# Altium schematic sheet Sensor_Temp.SchDoc: ZStation Sensor Temp
size A4; Engineer: Stephan Eersels; DocumentNumber: 12202925_ZS; Revision: 2.1; SheetNumber: 4; SheetTotal: 8
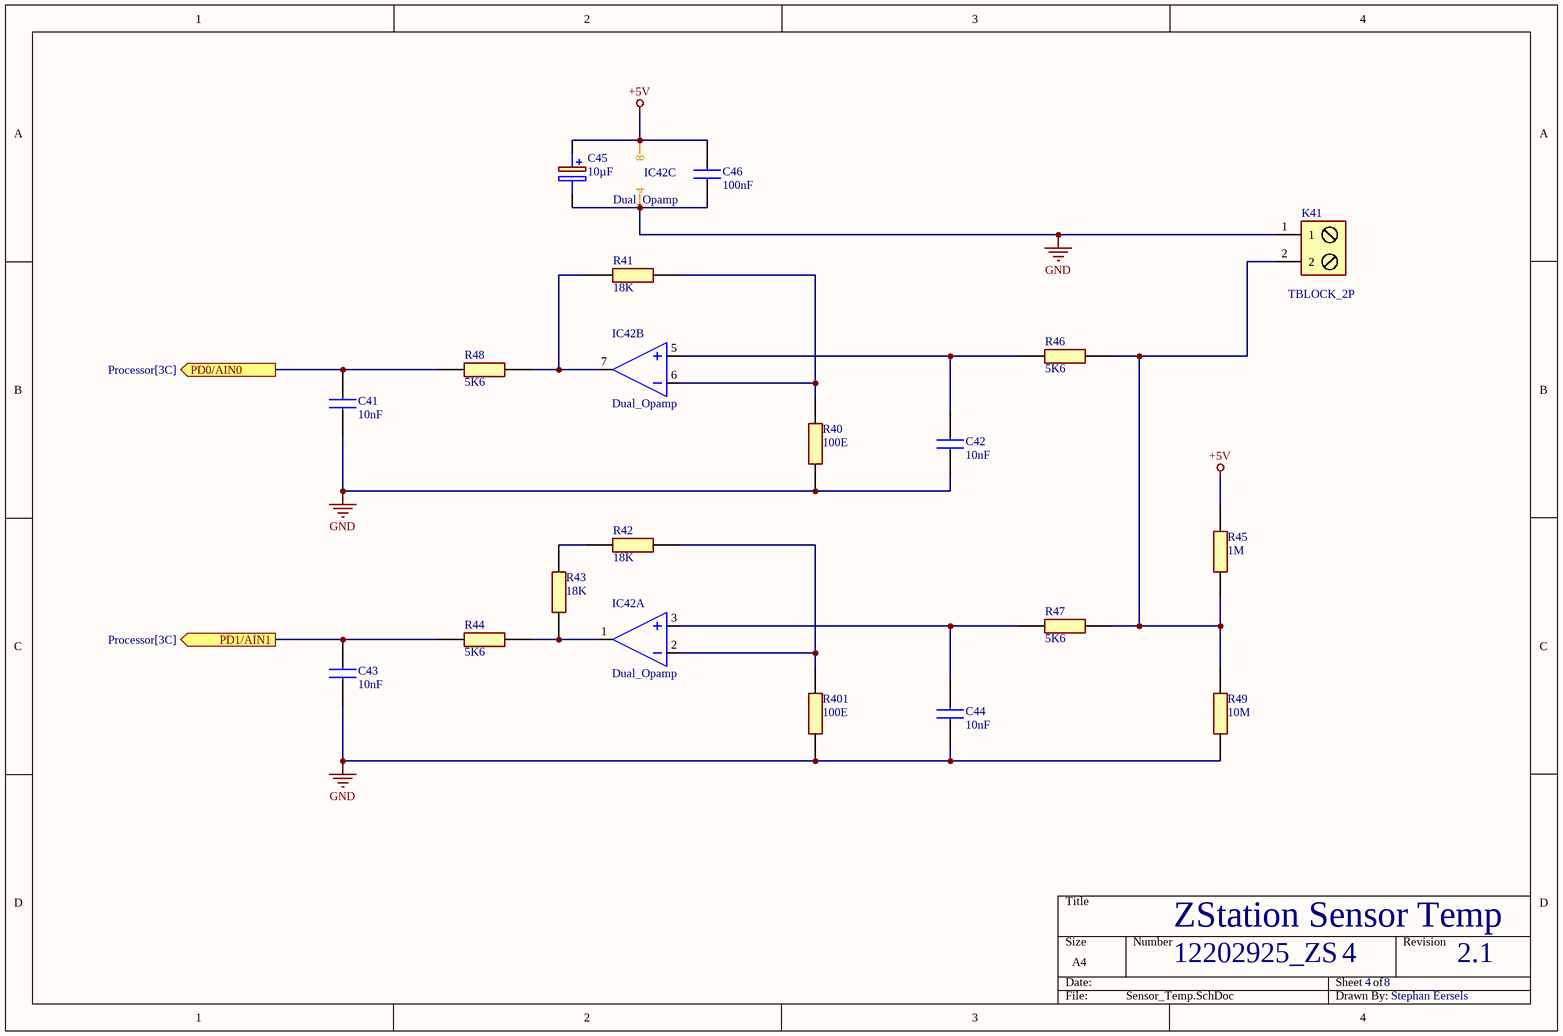
[diagram p0: Sensor_Temp.SchDoc]

## Parts
C41  10nF  [C315C103K5R5TA7303]
C42  10nF  [C315C103K5R5TA7303]
C43  10nF  [C315C103K5R5TA7303]
C44  10nF  [C315C103K5R5TA7303]
C45  10µF  [CAPPRD200W50D525H1250]
C46  100nF  [RDE5C1H330J0M1H03A]
IC42  Dual_Opamp  [DIP781W56P254L950H533Q8N]  (parts A,B,C of 3)
K41  TBLOCK_2P  [TBLOCK_2P]
R40  100E  [VISHAY_CMF_60]
R41  18K  [VISHAY_CMF_60]
R42  18K  [VISHAY_CMF_60]
R43  18K  [VISHAY_CMF_60]
R44  5K6  [VISHAY_CMF_60]
R45  1M  [VISHAY_CMF_60]
R46  5K6  [VISHAY_CMF_60]
R47  5K6  [VISHAY_CMF_60]
R48  5K6  [VISHAY_CMF_60]
R49  10M  [VISHAY_CMF_60]
R401  100E  [VISHAY_CMF_60]

## Ports
PD0/AIN0 (out, see Processor[3C]), PD1/AIN1 (out, see Processor[3C])

## Nets
+5V: C45.1(+) C46.1 IC42.8 R45.1
GND: C41.1 C42.1 C43.1 C44.1 C45.2(-) C46.2 IC42.4 K41.1 R40.2 R49.2 R401.2
PD0/AIN0: C41.2 R48.2 ; port PD0/AIN0
PD1/AIN1: C43.2 R44.2 ; port PD1/AIN1
NetC42_2: C42.2 IC42.5(VINB+) R46.2
NetC44_2: C44.2 IC42.3(VINA+) R47.2
NetIC42_1: IC42.1(VOUTA) R43.1 R44.1
NetIC42_2: IC42.2(VINA-) R42.2 R401.1
NetIC42_6: IC42.6(VINB-) R40.1 R41.2
NetIC42_7: IC42.7(VOUTB) R41.1 R48.1
NetK41_2: K41.2 R45.2 R46.1 R47.1 R49.1
NetR42_1: R42.1 R43.2

## Library data of the parts
C41-C44 = C315C103K5R5TA7303: GoldMax 300 Comm X7R, Ceramic, 0.01 uF, 10%, 50 VDC, 125 VDC, 125C, -55C, X7R, GoldMax, Commercial Standard, 2.5 % , 100 GOhms, 3.81mm, 3.14mm, 2.54mm, Lead Spacing = 2.54mm, 18mm, 0.51mm, 2500, 80; Manufacturer_Name: KEMET; Geometry.Height: 4.66mm; Mouser Part Number: 80-C315C103K5R-TR; Mouser Price/Stock: https://www.mouser.co.uk/ProductDetail/KEMET/C315C103K5R5TA7303?qs=LJ1pyEEo5rYBfSJP9%252BZ%252BkA%3D%3D; Manufacturer_Part_Number: C315C103K5R5TA7303; Datasheet Link: https://content.kemet.com/datasheets/KEM_C1050_GOLDMAX_X7R.pdf
C45 = CAP_10µF_50V: Aluminium Electrolytic Capacitors - Radial Leaded WCAP-AT1H 10uF 50V 20% Radial; Manufacturer_Name: Wurth Elektronik; Manufacturer_Part_Number: 860040473003; Datasheet Link: https://componentsearchengine.com/Datasheets/2/860040473003.pdf; Height: 12.5mm; Mouser Part Number: 710-860040473003; Mouser Price/Stock: https://www.mouser.co.uk/ProductDetail/Wurth-Elektronik/860040473003?qs=0KOYDY2FL29v2%2FALxGsSIw%3D%3D
C46 = CAP_100nF_50V: CAP, 0.1UF, 50V, MLCC, RADIAL; Manufacturer_Name: Murata Electronics; Manufacturer_Part_Number: RDER71H104K0K1H03B; Geometry.Height: 5mm; Mouser Part Number: 81-RDER71H104K0K1H3B; Mouser Price/Stock: https://www.mouser.co.uk/ProductDetail/Murata-Electronics/RDER71H104K0K1H03B?qs=hNud%2FORuBR2GLaz%2FjAabyQ%3D%3D; Datasheet Link: https://psearch.en.murata.com/capacitor/product/RDER71H104K0K1H03B.html
IC42 = Dual_Opamp: Slew Rate: 0.6V/µs; Supply Current: 100uA; Power Supply Rejection Ratio (PSRR): 86dB; Input Offset Voltage (Vos): 4.5mV; Input Bias Current: 1pA; Amplifier Type: GENERAL PURPOSE; Unity Gain Bandwidth Product: 1MHz; Number of Circuits: 2; Output Current: 23mA; Operating Supply Voltage: 5.5V; Min Supply Voltage: 1.8V; Common Mode Rejection Ratio: 60dB; Voltage Gain: 112dB; Max Supply Voltage: 6V; Package Quantity: 60; REACH SVHC: No SVHC; Min Operating Temperature: -40°C; Max Operating Temperature: 125°C; Mount: Through Hole; Nominal Supply Current: 100uA; Height: 3.3mm; Length: 9.27mm; Slew Rate-Nom: 0.6V/µs; Packaging: Rail/Tube; Output Current per Channel: 23mA; Number of Amplifiers: 2; RoHS Compliant: Yes; Radiation Hardening: No; Bandwidth: 1MHz; Lead Free: Lead Free; Width: 6.35mm; Number of Channels: 2; Gain Bandwidth Product: 1MHz; Technology: CMOS; Operating Supply Current: 100uA; Number of Elements: 2; Number of Pins: 8; Input Offset Voltage-Max: 4.5mV; Case/Package: PDIP
K41 = TBLOCK_2P: Connector; Manufacturer_Name: Wurth Elektronik; Manufacturer_Part_Number: 691104700002; Height: 7.7mm; Mouser Part Number: 710-691104700002; Mouser Price/Stock: https://www.mouser.co.uk/ProductDetail/Wurth-Elektronik/691104700002?qs=sPbYRqrBIVlxnZf2zP2Y8g%3D%3D
R40-R49 R401 = RES_68K_10K: Through Hole 1W 10/68 Kohms 1%; Manufacturer_Name: Vishay; Manufacturer_Part_Number: CMF6010K000FKEB; Datasheet Link: https://datasheet.datasheetarchive.com/originals/distributors/Datasheets-DGA8/3123891.pdf; Mouser Part Number: 71-CMF6010K000FKEB; Mouser Price/Stock: https://www.mouser.co.uk/ProductDetail/Vishay-Dale/CMF6010K000FKEB?qs=GEEnpASSx%2Fgpk8SPxIuFzw%3D%3D; Arrow Part Number: CMF6010K000FKEB; Arrow Price/Stock: https://www.arrow.com/en/products/cmf6010k000fkeb/vishay